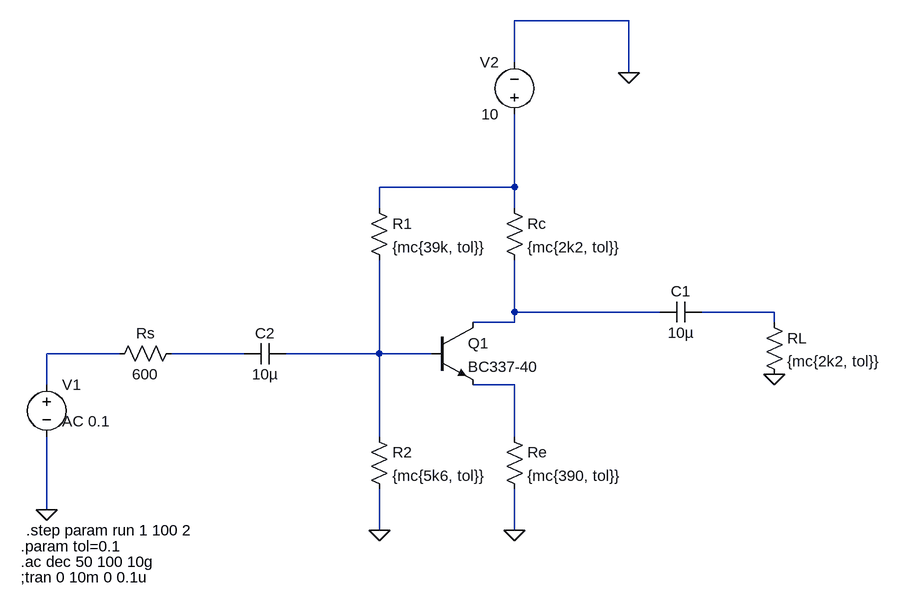
[diagram p0: schematic tp1_circ.asc]
tp1_circ.asc, the LTspice schematic file:
Version 4
SHEET 1 1404 696
WIRE 512 -176 336 -176
WIRE 336 -112 336 -176
WIRE 512 -96 512 -176
WIRE 336 80 336 -32
WIRE 336 80 128 80
WIRE 128 112 128 80
WIRE 336 112 336 80
WIRE 336 272 336 192
WIRE 560 272 336 272
WIRE 736 272 624 272
WIRE 336 288 336 272
WIRE 336 288 272 288
WIRE 736 288 736 272
WIRE -272 336 -384 336
WIRE -80 336 -192 336
WIRE 128 336 128 192
WIRE 128 336 -16 336
WIRE 208 336 128 336
WIRE -384 384 -384 336
WIRE 336 384 272 384
WIRE 128 464 128 336
WIRE 336 464 336 384
WIRE -384 576 -384 464
WIRE 128 608 128 544
WIRE 336 608 336 544
FLAG -384 576 0
FLAG 128 608 0
FLAG 336 608 0
FLAG 736 368 0
FLAG 512 -96 0
SYMBOL res 112 96 R0
SYMATTR InstName R1
SYMATTR Value {mc{39k, tol}}
SYMBOL res 320 96 R0
SYMATTR InstName Rc
SYMATTR Value {mc{2k2, tol}}
SYMBOL res 112 448 R0
SYMATTR InstName R2
SYMATTR Value {mc{5k6, tol}}
SYMBOL res 320 448 R0
SYMATTR InstName Re
SYMATTR Value {mc{390, tol}}
SYMBOL res -176 320 R90
WINDOW 0 0 56 VBottom 2
WINDOW 3 32 56 VTop 2
SYMATTR InstName Rs
SYMATTR Value 600
SYMBOL cap 560 288 R270
WINDOW 0 32 32 VTop 2
WINDOW 3 0 32 VBottom 2
SYMATTR InstName C1
SYMATTR Value 10µ
SYMBOL cap -80 352 R270
WINDOW 0 32 32 VTop 2
WINDOW 3 0 32 VBottom 2
SYMATTR InstName C2
SYMATTR Value 10µ
SYMBOL voltage -384 368 R0
WINDOW 3 24 44 Left 2
WINDOW 123 24 72 Left 2
WINDOW 39 24 72 Left 2
SYMATTR Value ""
SYMATTR Value2 AC 0.1
SYMATTR InstName V1
SYMBOL res 720 272 R0
SYMATTR InstName RL
SYMATTR Value {mc{2k2, tol}}
SYMBOL voltage 336 -16 R180
WINDOW 0 24 96 Left 2
WINDOW 3 24 16 Left 2
WINDOW 123 0 0 Left 2
WINDOW 39 0 0 Left 2
SYMATTR InstName V2
SYMATTR Value 10
SYMBOL npn 208 288 R0
SYMATTR InstName Q1
SYMATTR Value BC337-40
TEXT -424 656 Left 2 !.ac dec 50 100 10g
TEXT -424 680 Left 2 !;tran 0 10m 0 0.1u
TEXT -424 632 Left 2 !.param tol=0.1
TEXT -416 608 Left 2 !.step param run 1 100 2

The netlist it stands for:
* tp1_circ.asc
R1 N001 N006 {mc{39k, tol}}
Rc N001 N002 {mc{2k2, tol}}
R2 N006 0 {mc{5k6, tol}}
Re N007 0 {mc{390, tol}}
Rs N005 N004 600
C1 N002 N003 10µ
C2 N005 N006 10µ
V1 N004 0 AC 0.1
RL N003 0 {mc{2k2, tol}}
V2 N001 0 10
Q1 N002 N006 N007 0 BC337-40
.model NPN NPN
.model PNP PNP
.lib standard.bjt
.ac dec 50 100 10g
;tran 0 10m 0 0.1u
.param tol=0.1
.step param run 1 100 2
.backanno
.end